# Altium project PRJ_Collar-V1.PrjPcb
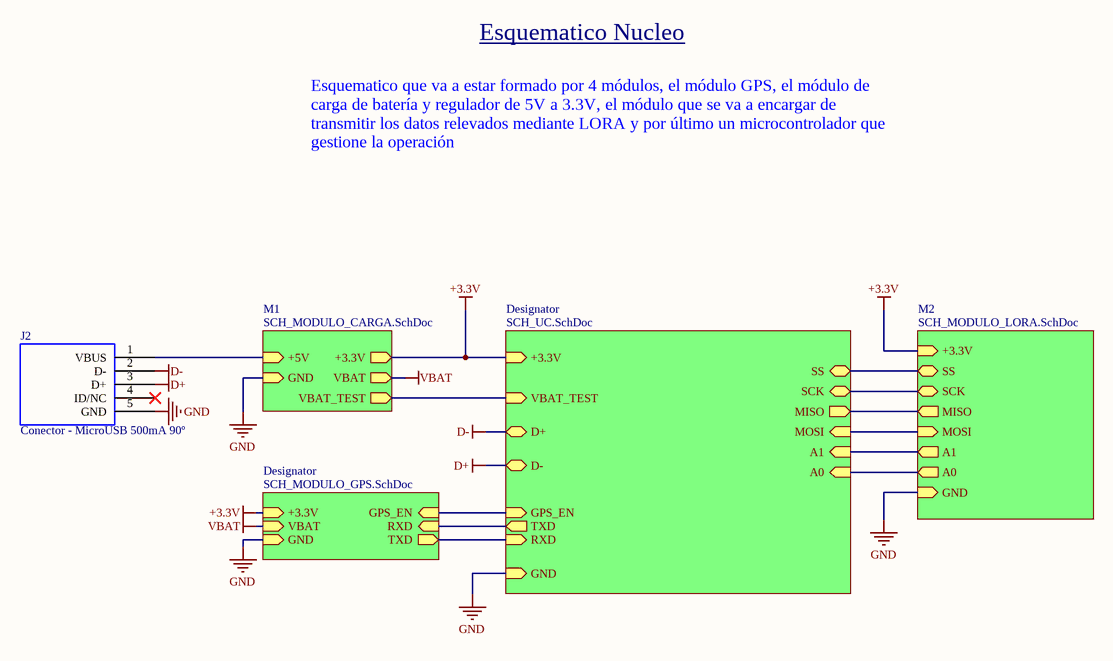
[diagram p0: SCH_NUCLEO.SchDoc]
5 sheets, 52 parts. Net scope: hierarchical (ports join the sheet entries above them; power ports are global).
Sheets:
  SCH_NUCLEO.SchDoc
    M1 = SCH_MODULO_CARGA.SchDoc
    M2 = SCH_MODULO_LORA.SchDoc
    Designator = SCH_MODULO_GPS.SchDoc
    Designator = SCH_UC.SchDoc

## Sheet SCH_NUCLEO.SchDoc
size A4

### Parts
J2  Conector - MicroUSB 500mA 90º

### Sub-sheets
Designator = SCH_MODULO_GPS.SchDoc: +3.3V (in), VBAT (in), GND (in), GPS_EN (in), RXD (in), TXD (out)
Designator = SCH_UC.SchDoc: VBAT_TEST (in), D+ (bidir), MISO (out), A0 (in), GND (in), MOSI (in), +3.3V (in), GPS_EN (in), SCK (bidir), A1 (in), SS (bidir), D- (bidir), TXD (out), RXD (in)
M1 = SCH_MODULO_CARGA.SchDoc: +5V (in), GND (in), +3.3V (out), VBAT (out), VBAT_TEST (out)
M2 = SCH_MODULO_LORA.SchDoc: SCK (bidir), SS (bidir), GND (in), +3.3V (in), MISO (out), MOSI (in), A1 (out), A0 (out)

### Nets
+3.3V: sheet M1/+3.3V, sheet M2/+3.3V, sheet Designator/+3.3V, sheet Designator/+3.3V
+5V: J2.1(VBUS) ; sheet M1/+5V
A0: sheet M2/A0, sheet Designator/A0
A1: sheet M2/A1, sheet Designator/A1
D+: J2.3(D+) ; sheet Designator/D-
D-: J2.2(D-) ; sheet Designator/D+
GND: J2.5(GND) ; sheet M1/GND, sheet M2/GND, sheet Designator/GND, sheet Designator/GND
GPS_EN: sheet Designator/GPS_EN, sheet Designator/GPS_EN
MOSI: sheet M2/MOSI, sheet Designator/MOSI
RXD: sheet Designator/RXD, sheet Designator/TXD
SCK: sheet M2/SCK, sheet Designator/SCK
SPI_MISO: sheet M2/MISO, sheet Designator/MISO
SPI_NSS: sheet M2/SS, sheet Designator/SS
TXD: sheet Designator/TXD, sheet Designator/RXD
VBAT: sheet M1/VBAT, sheet Designator/VBAT
VBAT_TEST: sheet M1/VBAT_TEST, sheet Designator/VBAT_TEST

Not connected (* = marked no-connect by the designer): J2 4(ID/NC)*

### Notes on the sheet
- Esquematico Nucleo
- Esquematico que va a estar formado por 4 módulos, el módulo GPS, el módulo de carga de batería y regulador de 5V a 3.3V, el módulo que se va a encargar de transmitir los datos relevados mediante LORA y por último un microcontrolador que gestione la operación
- 27/06/20
- Fecha
- Cambio Formulario
- Emision Inicial
- Versión
- 00
- Producto
- Código
- Cambio Circuito Eléctrico
- CI N°
- Nivel
- UBM:
- Revisó
- Cód. Formulario
- Realizó
- 1
- PF-ID-014-P
- Aprobó
- Vigencia
- COPIA NO CONTROLADA AL IMPRIMIR
- 15/05/2016
- A4
- Cargo
- 1/1

### Library data of the parts
J2 = Conector - MicroUSB 500mA 90º: Conector Micro USB

## Sheet SCH_MODULO_CARGA.SchDoc
size A4
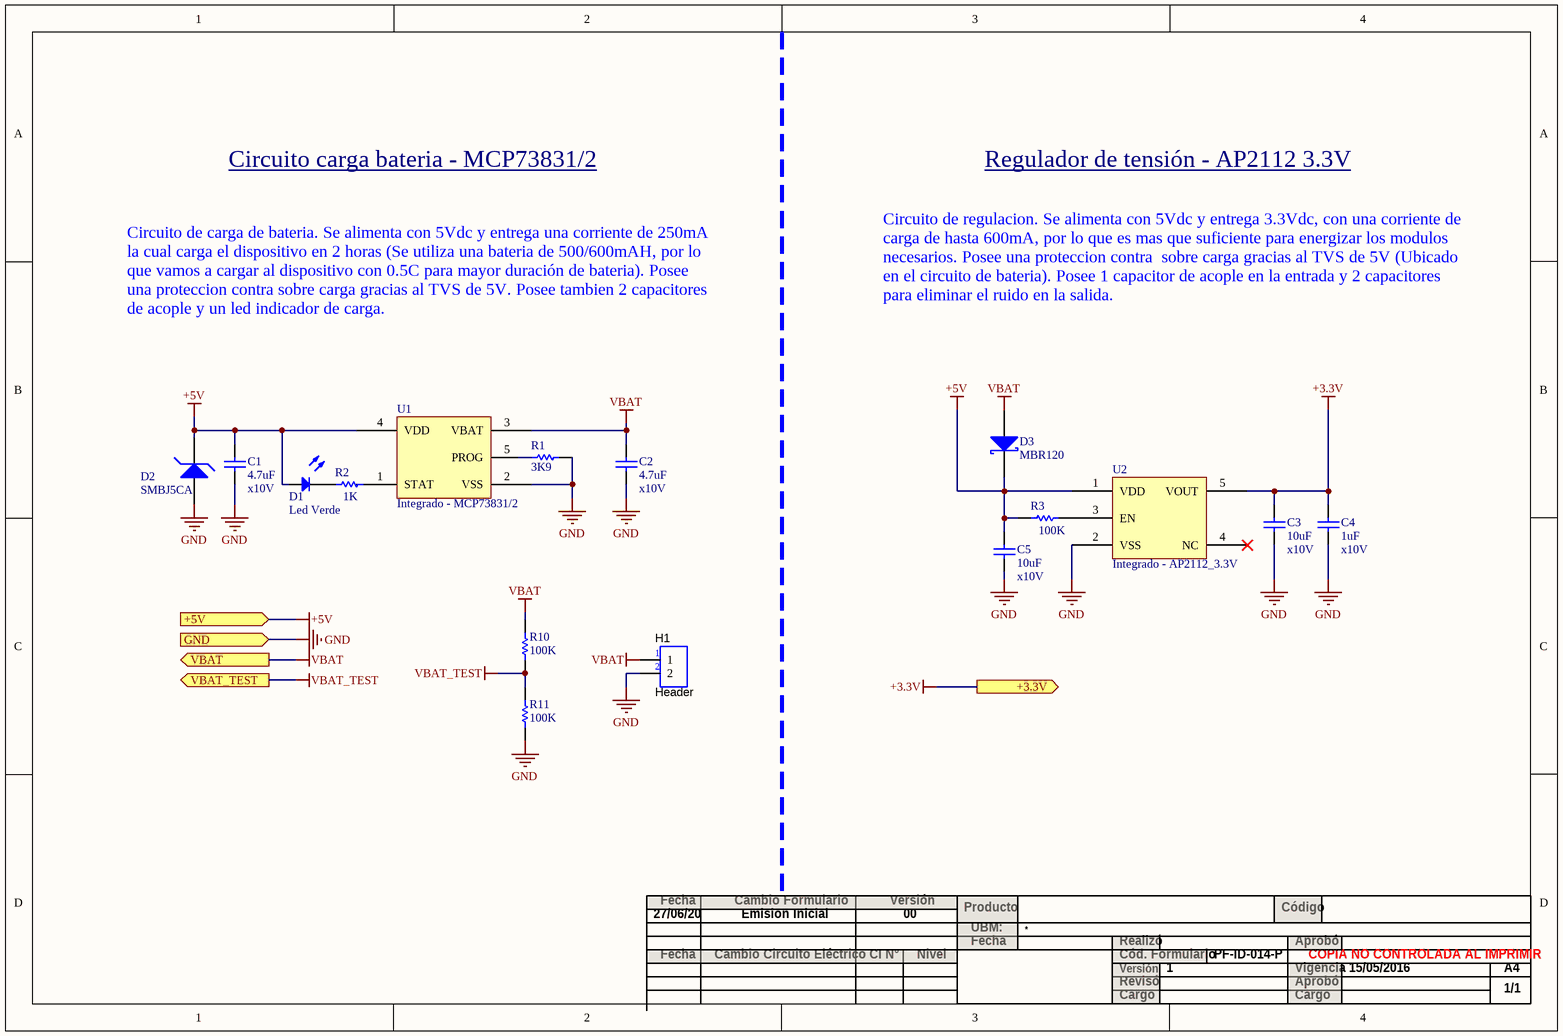
[diagram p1: SCH_MODULO_CARGA.SchDoc]

### Parts
C1  value 4.7uF  Voltage: x10V  [RAD-0.3]  (hidden comment: Capacitor - Común)
C2  value 4.7uF  Voltage: x10V  [RAD-0.3]  (hidden comment: Capacitor - Común)
C3  value 10uF  Voltage: x10V  [RAD-0.3]  (hidden comment: Capacitor - Común)
C4  value 1uF  Voltage: x10V  [RAD-0.3]  (hidden comment: Capacitor - Común)
C5  value 10uF  Voltage: x10V  [RAD-0.3]  (hidden comment: Capacitor - Común)
D1  Led Verde  [LED-0]
D2  SMBJ5CA  [SMC]
D3  MBR120  [SMB]
H1  Header  [HDR_1x2_Offset]  (no BOM)
R1  value 3K9  [Res_0603]  (hidden comment: Resistencia - Común)
R2  value 1K  [Res_0603]  (hidden comment: Resistencia - Común)
R3  value 100K  [Res_0603]  (hidden comment: Resistencia - Común)
R10  value 100K  [AXIAL-0.5]  (hidden comment: Resistencia - Común)
R11  value 100K  [AXIAL-0.5]  (hidden comment: Resistencia - Común)
U1  Integrado - MCP73831/2  [SOT23-5]
U2  Integrado - AP2112_3.3V  [SOT23-5]

### Ports
+3.3V (out), +5V (in), GND (in), VBAT (out), VBAT_TEST (out)

### Nets
+3.3V: C3.2 C4.2 U2.5(VOUT) ; port +3.3V
+5V: C1.1 C5.2 D1.1(A) D2.2(K) D3.2(K) R3.1 U1.4(VDD) U2.1(VDD) ; port +5V
GND: C1.2 C2.1 C3.1 C4.1 C5.1 D2.1(A) H1.2 R1.2 R11.1 U1.2(VSS) U2.2(VSS) ; port GND
VBAT: C2.2 D3.1(A) H1.1 R10.2 U1.3(VBAT) ; port VBAT
VBAT_TEST: R10.1 R11.2 ; port VBAT_TEST
NetD1_2: D1.2(K) R2.1
NetR1_1: R1.1 U1.5(PROG)
NetR3_2: R3.2 U2.3(EN)

Not connected (* = marked no-connect by the designer): R2 2; U1 1(STAT); U2 4(NC)*

### Notes on the sheet
- Circuito carga bateria - MCP73831/2
- Regulador de tensión - AP2112 3.3V
- Circuito de carga de bateria. Se alimenta con 5Vdc y entrega una corriente de 250mA la cual carga el dispositivo en 2 horas (Se utiliza una bateria de 500/600mAH, por lo que vamos a cargar al dispositivo con 0.5C para mayor duración de bateria). Posee una proteccion contra sobre carga gracias al TVS de 5V. Posee tambien 2 capacitores de acople y un led indicador de carga.
- Circuito de regulacion. Se alimenta con 5Vdc y entrega 3.3Vdc, con una corriente de carga de hasta 600mA, por lo que es mas que suficiente para energizar los modulos necesarios. Posee una proteccion contra  sobre carga gracias al TVS de 5V (Ubicado en el circuito de bateria). Posee 1 capacitor de acople en la entrada y 2 capacitores para eliminar el ruido en la salida.
- 27/06/20
- Fecha
- Cambio Formulario
- Emision Inicial
- Versión
- 00
- Producto
- Código
- Cambio Circuito Eléctrico
- CI N°
- Nivel
- UBM:
- Revisó
- Cód. Formulario
- Realizó
- 1
- PF-ID-014-P
- Aprobó
- Vigencia
- COPIA NO CONTROLADA AL IMPRIMIR
- 15/05/2016
- A4
- Cargo
- 1/1

### Library data of the parts
C1-C5 = Capacitor - Común: Capacitor; Published: 8-Jun-2000; LatestRevisionDate: 17-Jul-2002; LatestRevisionNote: Re-released for DXP Platform.; PackageReference: RAD-0.3; Publisher: Altium Limited; PackageDescription: Radial Cap, Thru-Hole; 2 Leads; 0.3 in Pin Spacing
D1 = Diodo - LED: Diodo Led; Published: 8-Jun-2000; LatestRevisionDate: 08-Jul-2005; LatestRevisionNote: Mech Layer 1 removed.; PackageReference: LED-0; Publisher: Altium Limited; PackageDescription: LED; 2 Leads
D2 = Diodo - TVS: Default Diode; Published: 8-Jun-2000; LatestRevisionDate: 17-Jul-2002; LatestRevisionNote: Re-released for DXP Platform.; PackageVersion: Sep-1996; PackageReference: SMC; Publisher: Altium Limited; PackageDescription: DO-214-AB/SMC; 2 C-Bend Leads; Body 7.9 x 5.9 mm, inc. leads (LxW); Code_JEDEC: DO-214-AB
D3 = Diodo - Schottky: Schottky Diode; Published: 8-Jun-2000; LatestRevisionDate: 17-Jul-2002; LatestRevisionNote: Re-released for DXP Platform.; PackageReference: SMB; Publisher: Altium Limited; PackageDescription: DO-214-AA/SMB; 2 C-Bend Leads; Body 5.3 x 3.6 mm, inc. leads (LxW); Code_JEDEC: DO-214-AA
H1 = Conector - 2 Pos: Header, 2-pin
R1-R3 R10 R11 = Resistencia - Común: Semiconductor Resistor; Published: 8-Jun-2000; LatestRevisionDate: 17-Jul-2002; LatestRevisionNote: Re-released for DXP Platform.; PackageReference: AXIAL-0.5; Publisher: Altium Limited; PackageDescription: Axial Device, Thru-Hole; 2 Leads; 0.5 in Pin Spacing
U1 = Integrado - MCP73831/2: Cargador bateria Litio 3,7V
U2 = Integrado - AP2112_3.3V: Regulador 3.3V 600mA

## Sheet SCH_MODULO_LORA.SchDoc
size A4
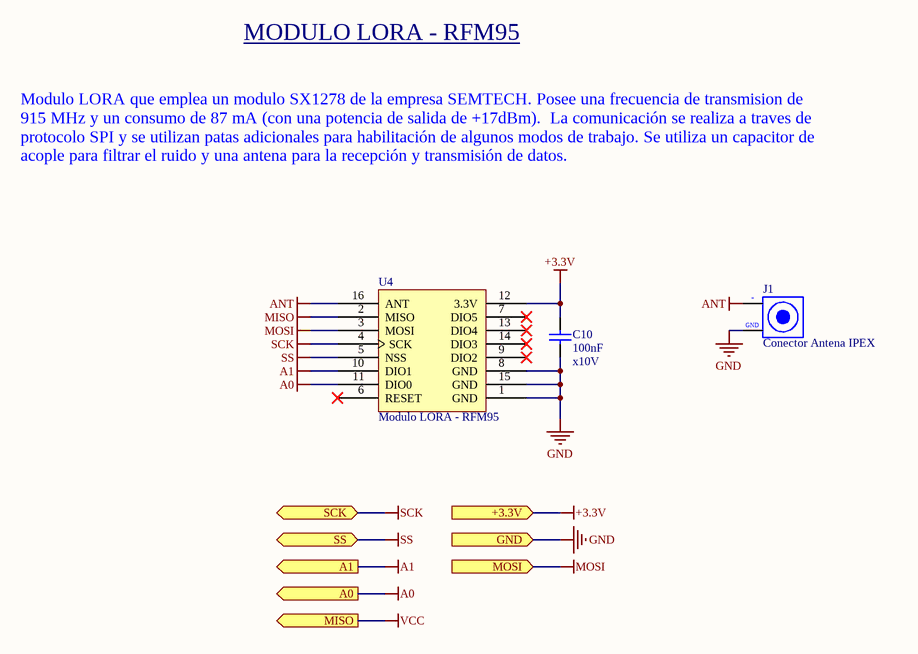
[diagram p2: SCH_MODULO_LORA.SchDoc]

### Parts
C10  value 100nF  Voltage: x10V  [RAD-0.3]  (hidden comment: Capacitor - Común)
J1  Conector Antena IPEX
U4  Modulo LORA - RFM95

### Ports
+3.3V (in), A0 (out), A1 (out), GND (in), MISO (out), MOSI (in), SCK (bidir), SS (bidir)

### Nets
+3.3V: C10.2 U4.12(3.3V) ; port +3.3V
A0: U4.11(DIO0) ; port A0
A1: U4.10(DIO1) ; port A1
ANT: J1.1(ANT) U4.16(ANT)
GND: C10.1 J1.2 U4.1(GND) U4.8(GND) U4.15(GND) ; port GND
MISO: U4.2(MISO)
MOSI: U4.3(MOSI) ; port MOSI
SCK: U4.4(SCK) ; port SCK
SS: U4.5(NSS) ; port SS  [project net SPI_NSS]

Not connected (* = marked no-connect by the designer): U4 6(RESET)* 7(DIO5)* 9(DIO2)* 13(DIO4)* 14(DIO3)*

### Notes on the sheet
- MODULO LORA - RFM95
- Modulo LORA que emplea un modulo SX1278 de la empresa SEMTECH. Posee una frecuencia de transmision de 915 MHz y un consumo de 87 mA (con una potencia de salida de +17dBm).  La comunicación se realiza a traves de protocolo SPI y se utilizan patas adicionales para habilitación de algunos modos de trabajo. Se utiliza un capacitor de acople para filtrar el ruido y una antena para la recepción y transmisión de datos.
- 27/06/20
- Fecha
- Cambio Formulario
- Emision Inicial
- Versión
- 00
- Producto
- Código
- Cambio Circuito Eléctrico
- CI N°
- Nivel
- UBM:
- Revisó
- Cód. Formulario
- Realizó
- 1
- PF-ID-014-P
- Aprobó
- Vigencia
- COPIA NO CONTROLADA AL IMPRIMIR
- 15/05/2016
- A4
- Cargo
- 1/1
- (in symbol Conector Antena IPEX) +; GND

### Library data of the parts
C10 = Capacitor - Común: Capacitor; Published: 8-Jun-2000; LatestRevisionDate: 17-Jul-2002; LatestRevisionNote: Re-released for DXP Platform.; PackageReference: RAD-0.3; Publisher: Altium Limited; PackageDescription: Radial Cap, Thru-Hole; 2 Leads; 0.3 in Pin Spacing
J1 = Conector Antena IPEX: IPEX MHF3
U4 = Modulo LORA - RFM95: RFM95-915-S2

## Sheet SCH_MODULO_GPS.SchDoc
size A4
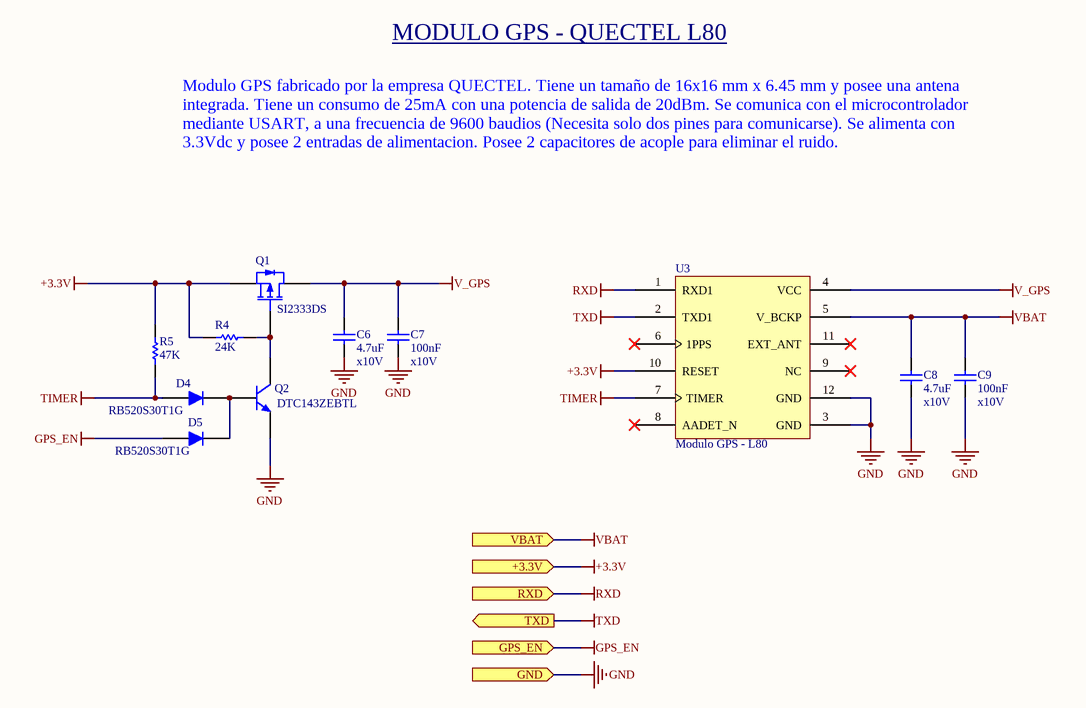
[diagram p3: SCH_MODULO_GPS.SchDoc]

### Parts
C6  value 4.7uF  Voltage: x10V  [RAD-0.3]  (hidden comment: Capacitor - Común)
C7  value 100nF  Voltage: x10V  [RAD-0.3]  (hidden comment: Capacitor - Común)
C8  value 4.7uF  Voltage: x10V  [RAD-0.3]  (hidden comment: Capacitor - Común)
C9  value 100nF  Voltage: x10V  [RAD-0.3]  (hidden comment: Capacitor - Común)
D4  RB520S30T1G  [SMC]
D5  RB520S30T1G  [SMC]
Q1  SI2333DS  [E3]
Q2  DTC143ZEBTL  [TO-92A]
R4  value 24K  [AXIAL-0.5]  (hidden comment: Resistencia - Común)
R5  value 47K  [AXIAL-0.5]  (hidden comment: Resistencia - Común)
U3  Modulo GPS - L80

### Ports
+3.3V (in), GND (in), GPS_EN (in), RXD (in), TXD (out), VBAT (in)

### Nets
+3.3V: Q1.3(S) R4.1 R5.2 U3.10(RESET) ; port +3.3V
GND: C6.1 C7.1 C8.1 C9.1 Q2.1(E) U3.3(GND) U3.12(GND) ; port GND
GPS_EN: D5.1(A) ; port GPS_EN
RXD: U3.1(RXD1) ; port RXD
TIMER: D4.1(A) R5.1 U3.7(TIMER)
TXD: U3.2(TXD1) ; port TXD
V_GPS: C6.2 C7.2 Q1.1(D) U3.4(VCC)
VBAT: C8.2 C9.2 U3.5(V_BCKP) ; port VBAT
NetD4_2: D4.2(K) D5.2(K) Q2.2(B)
NetQ1_2: Q1.2(G) Q2.3(C) R4.2

Not connected (* = marked no-connect by the designer): U3 6(1PPS)* 8(AADET_N)* 9(NC)* 11(EXT_ANT)*

### Notes on the sheet
- MODULO GPS - QUECTEL L80
- Modulo GPS fabricado por la empresa QUECTEL. Tiene un tamaño de 16x16 mm x 6.45 mm y posee una antena integrada. Tiene un consumo de 25mA con una potencia de salida de 20dBm. Se comunica con el microcontrolador mediante USART, a una frecuencia de 9600 baudios (Necesita solo dos pines para comunicarse). Se alimenta con 3.3Vdc y posee 2 entradas de alimentacion. Posee 2 capacitores de acople para eliminar el ruido.
- 27/06/20
- Fecha
- Cambio Formulario
- Emision Inicial
- Versión
- 00
- Producto
- Código
- Cambio Circuito Eléctrico
- CI N°
- Nivel
- UBM:
- Revisó
- Cód. Formulario
- Realizó
- 1
- PF-ID-014-P
- Aprobó
- Vigencia
- COPIA NO CONTROLADA AL IMPRIMIR
- 15/05/2016
- A4
- Cargo
- 1/1

### Library data of the parts
C6-C9 = Capacitor - Común: Capacitor; Published: 8-Jun-2000; LatestRevisionDate: 17-Jul-2002; LatestRevisionNote: Re-released for DXP Platform.; PackageReference: RAD-0.3; Publisher: Altium Limited; PackageDescription: Radial Cap, Thru-Hole; 2 Leads; 0.3 in Pin Spacing
D4 D5 = Diodo - Común: Default Diode; Published: 8-Jun-2000; LatestRevisionDate: 17-Jul-2002; LatestRevisionNote: Re-released for DXP Platform.; PackageVersion: Sep-1996; PackageReference: SMC; Publisher: Altium Limited; PackageDescription: DO-214-AB/SMC; 2 C-Bend Leads; Body 7.9 x 5.9 mm, inc. leads (LxW); Code_JEDEC: DO-214-AB
Q1 = Transistor - MOS/P: P-Channel MOSFET; Published: 8-Jun-2000; LatestRevisionDate: 17-Jul-2002; LatestRevisionNote: Re-released for DXP Platform.; PackageVersion: 1995/1996; PackageReference: E3; Publisher: Altium Limited; PackageDescription: TO, Flat Index; 3 In-Line, Axial Leads; Body Dia. 4.6mm; Lead Dia. 0.5 mm (max)
Q2 = Transistor - NPN: NPN General Purpose Amplifier; Published: 8-Jun-2000; LatestRevisionDate: 15-Jan-2003; LatestRevisionNote: PCB Footprint 'BCY-W3/D4.7' replaced; DatasheetVersion: 1997; PackageVersion: Sep-1998; PackageReference: TO-92A; Publisher: Altium Limited; PackageDescription: TO, Flat Index; 3 In-Line, Axial Leads; Body Dia. 4.5mm; Leads 0.51 x 0.48 mm (max); ComponentLink1Description: Manufacturer Link; ComponentLink1URL: http://www.fairchildsemi.com/; ComponentLink2Description: Datasheet; ComponentLink2URL: http://www.fairchildsemi.com/ds/2N%2F2N3904.pdf
R4 R5 = Resistencia - Común: Semiconductor Resistor; Published: 8-Jun-2000; LatestRevisionDate: 17-Jul-2002; LatestRevisionNote: Re-released for DXP Platform.; PackageReference: AXIAL-0.5; Publisher: Altium Limited; PackageDescription: Axial Device, Thru-Hole; 2 Leads; 0.5 in Pin Spacing
U3 = Modulo GPS - L80: QUECTEL L80

## Sheet SCH_UC.SchDoc
size A4
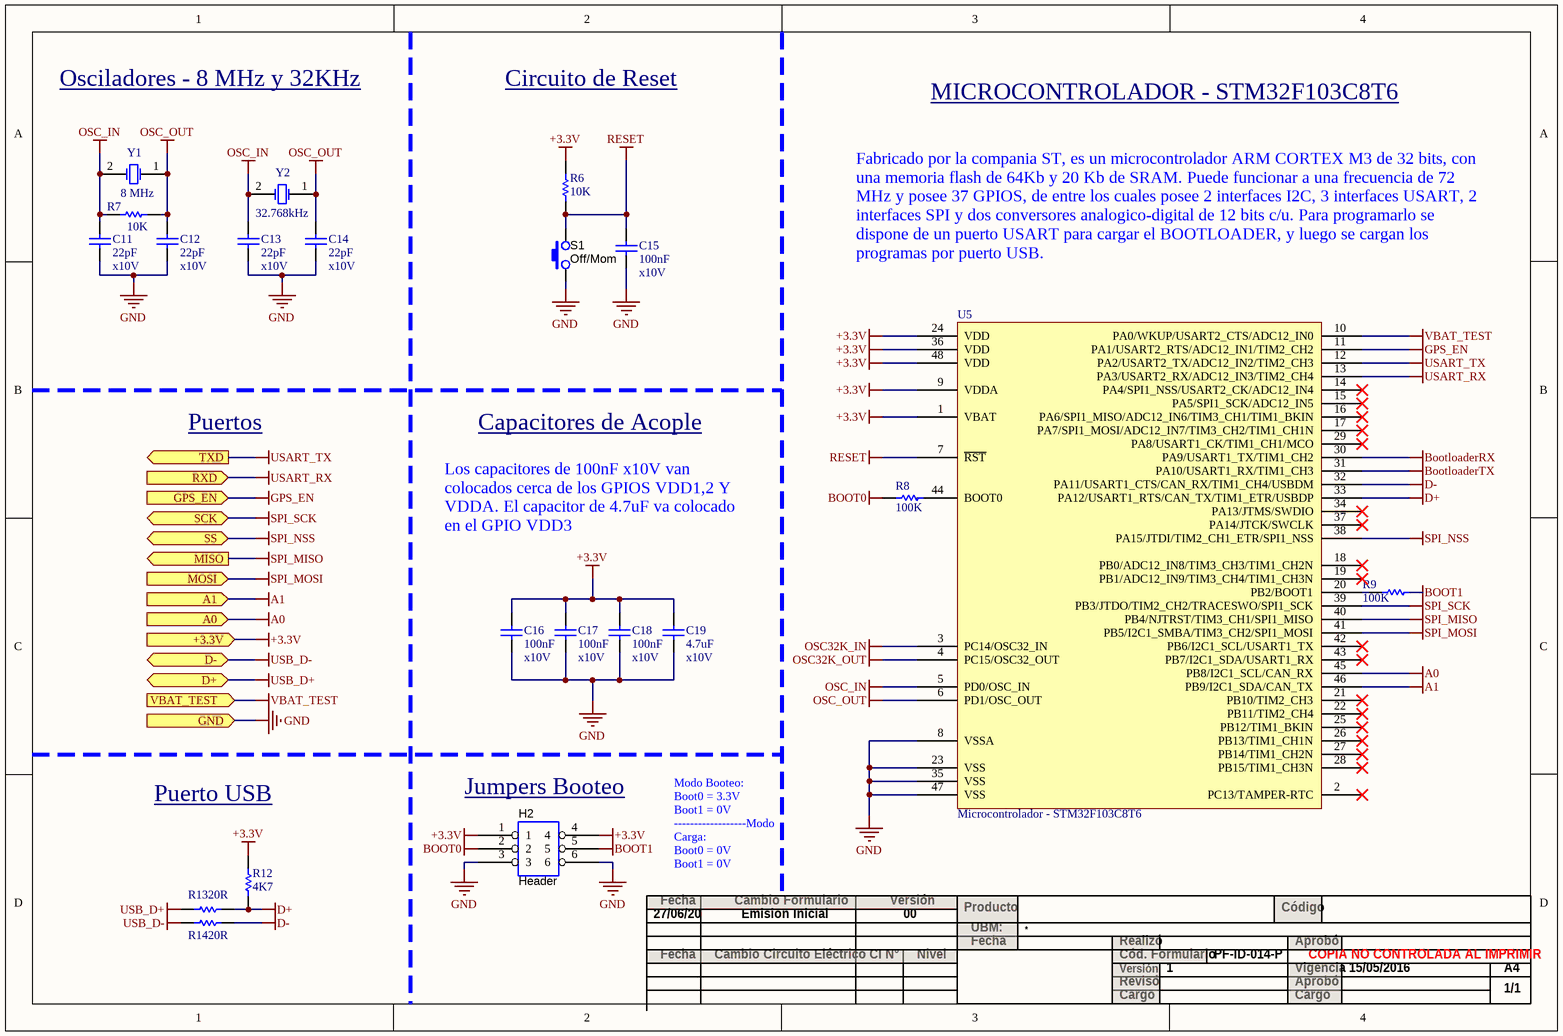
[diagram p4: SCH_UC.SchDoc]

### Parts
C11  value 22pF  Voltage: x10V  [RAD-0.3]  (hidden comment: Capacitor - Común)
C12  value 22pF  Voltage: x10V  [RAD-0.3]  (hidden comment: Capacitor - Común)
C13  value 22pF  Voltage: x10V  [RAD-0.3]  (hidden comment: Capacitor - Común)
C14  value 22pF  Voltage: x10V  [RAD-0.3]  (hidden comment: Capacitor - Común)
C15  value 100nF  Voltage: x10V  [RAD-0.3]  (hidden comment: Capacitor - Común)
C16  value 100nF  Voltage: x10V  [RAD-0.3]  (hidden comment: Capacitor - Común)
C17  value 100nF  Voltage: x10V  [RAD-0.3]  (hidden comment: Capacitor - Común)
C18  value 100nF  Voltage: x10V  [RAD-0.3]  (hidden comment: Capacitor - Común)
C19  value 4.7uF  Voltage: x10V  [RAD-0.3]  (hidden comment: Capacitor - Común)
H2  Header  [HDR_1x2_Offset]  (no BOM)
R6  value 10K  [AXIAL-0.5]  (hidden comment: Resistencia - Común)
R7  value 10K  [AXIAL-0.5]  (hidden comment: Resistencia - Común)
R8  value 100K  [AXIAL-0.5]  (hidden comment: Resistencia - Común)
R9  value 100K  [AXIAL-0.5]  (hidden comment: Resistencia - Común)
R12  value 4K7  [AXIAL-0.5]  (hidden comment: Resistencia - Común)
R13  value 20R  [AXIAL-0.5]  (hidden comment: Resistencia - Común)
R14  value 20R  [AXIAL-0.5]  (hidden comment: Resistencia - Común)
S1  Function: Off/Mom  [SWITCH_DPDT_RA_7201K2A]  (hidden comment: OFF-MOM)
U5  Microcontrolador - STM32F103C8T6
Y1  8 MHz  [R38]
Y2  32.768kHz  [R38]

### Ports
+3.3V (in), A0 (in), A1 (in), D+ (bidir), D- (bidir), GND (in), GPS_EN (in), MISO (out), MOSI (in), RXD (in), SCK (bidir), SS (bidir), TXD (out), VBAT_TEST (in)

### Nets
+3.3V: C16.2 C17.2 C18.2 C19.2 H2.1 H2.4 R6.2 R12.2 U5.1(VBAT) U5.9(VDDA) U5.24(VDD) U5.36(VDD) U5.48(VDD) ; port +3.3V
A0: U5.45(PB8/I2C1_SCL/CAN_RX) ; port A0
A1: U5.46(PB9/I2C1_SDA/CAN_TX) ; port A1
BOOT0: H2.2 R8.2
BOOT1: H2.5 R9.1
BootloaderRX: U5.30(PA9/USART1_TX/TIM1_CH2)
BootloaderTX: U5.31(PA10/USART1_RX/TIM1_CH3)
D+: R12.1 R13.1 R14.2 U5.33(PA12/USART1_RTS/CAN_TX/TIM1_ETR/USBDP) ; port D-  [also labelled USB_D-]
D-: R13.2 R14.1 U5.32(PA11/USART1_CTS/CAN_RX/TIM1_CH4/USBDM) ; port D+  [also labelled USB_D+]
GND: C11.2 C12.2 C13.2 C14.2 C15.1 C16.1 C17.1 C18.1 C19.1 H2.3 H2.6 S1.1 U5.8(VSSA) U5.23(VSS) U5.35(VSS) U5.47(VSS) ; port GND
GPS_EN: U5.11(PA1/USART2_RTS/ADC12_IN1/TIM2_CH2) ; port GPS_EN
OSC32K_IN: U5.3(PC14/OSC32_IN)
OSC32K_OUT: U5.4(PC15/OSC32_OUT)
OSC_IN: C11.1 C13.1 R7.2 U5.5(PD0/OSC_IN) Y1.2(OSC2) Y2.2(OSC2)
OSC_OUT: C12.1 C14.1 R7.1 U5.6(PD1/OSC_OUT) Y1.1(OSC1) Y2.1(OSC1)
RESET: C15.2 R6.1 S1.2 U5.7(~{RST})
SPI_MISO: U5.40(PB4/NJTRST/TIM3_CH1/SPI1_MISO) ; port MISO
SPI_MOSI: U5.41(PB5/I2C1_SMBA/TIM3_CH2/SPI1_MOSI) ; port MOSI  [project net MOSI]
SPI_NSS: U5.38(PA15/JTDI/TIM2_CH1_ETR/SPI1_NSS) ; port SS
SPI_SCK: U5.39(PB3/JTDO/TIM2_CH2/TRACESWO/SPI1_SCK) ; port SCK  [project net SCK]
USART_RX: U5.13(PA3/USART2_RX/ADC12_IN3/TIM2_CH4) ; port RXD  [project net TXD]
USART_TX: U5.12(PA2/USART2_TX/ADC12_IN2/TIM2_CH3) ; port TXD  [project net RXD]
VBAT_TEST: U5.10(PA0/WKUP/USART2_CTS/ADC12_IN0) ; port VBAT_TEST
NetR9_2: R9.2 U5.20(PB2/BOOT1)

Not connected (* = marked no-connect by the designer): R8 1; U5 2(PC13/TAMPER-RTC)* 14(PA4/SPI1_NSS/USART2_CK/ADC12_IN4)* 15(PA5/SPI1_SCK/ADC12_IN5)* 16(PA6/SPI1_MISO/ADC12_IN6/TIM3_CH1/TIM1_BKIN)* 17(PA7/SPI1_MOSI/ADC12_IN7/TIM3_CH2/TIM1_CH1N)* 18(PB0/ADC12_IN8/TIM3_CH3/TIM1_CH2N)* 19(PB1/ADC12_IN9/TIM3_CH4/TIM1_CH3N)* 21(PB10/TIM2_CH3)* 22(PB11/TIM2_CH4)* 25(PB12/TIM1_BKIN)* 26(PB13/TIM1_CH1N)* 27(PB14/TIM1_CH2N)* 28(PB15/TIM1_CH3N)* 29(PA8/USART1_CK/TIM1_CH1/MCO)* 34(PA13/JTMS/SWDIO)* 37(PA14/JTCK/SWCLK)* 42(PB6/I2C1_SCL/USART1_TX)* 43(PB7/I2C1_SDA/USART1_RX)* 44(BOOT0)

### Notes on the sheet
- Osciladores - 8 MHz y 32KHz
- Circuito de Reset
- MICROCONTROLADOR - STM32F103C8T6
- (near U5) Fabricado por la compania ST, es un microcontrolador ARM CORTEX M3 de 32 bits, con una memoria flash de 64Kb y 20 Kb de SRAM. Puede funcionar a una frecuencia de 72 MHz y posee 37 GPIOS, de entre los cuales posee 2 interfaces I2C, 3 interfaces USART, 2 interfaces SPI y dos conversores analogico-digital de 12 bits c/u. Para programarlo se dispone de un puerto USART para cargar el BOOTLOADER, y luego se cargan los programas por puerto USB.
- Puertos
- Capacitores de Acople
- Los capacitores de 100nF x10V van colocados cerca de los GPIOS VDD1,2 Y VDDA. El capacitor de 4.7uF va colocado en el GPIO VDD3
- Puerto USB
- (near H2) Jumpers Booteo
- Modo Booteo:
  Boot0 = 3.3V
  Boot1 = 0V
  ------------------Modo Carga:
  Boot0 = 0V
  Boot1 = 0V
- 27/06/20
- Fecha
- Cambio Formulario
- Emision Inicial
- Versión
- 00
- Producto
- Código
- Cambio Circuito Eléctrico
- CI N°
- Nivel
- UBM:
- Revisó
- Cód. Formulario
- Realizó
- 1
- PF-ID-014-P
- Aprobó
- Vigencia
- COPIA NO CONTROLADA AL IMPRIMIR
- 15/05/2016
- A4
- Cargo
- 1/1

### Library data of the parts
C11-C19 = Capacitor - Común: Capacitor; Published: 8-Jun-2000; LatestRevisionDate: 17-Jul-2002; LatestRevisionNote: Re-released for DXP Platform.; PackageReference: RAD-0.3; Publisher: Altium Limited; PackageDescription: Radial Cap, Thru-Hole; 2 Leads; 0.3 in Pin Spacing
H2 = Conector - 6 Pos: Header, 6-pin
R6-R9 R12-R14 = Resistencia - Común: Semiconductor Resistor; Published: 8-Jun-2000; LatestRevisionDate: 17-Jul-2002; LatestRevisionNote: Re-released for DXP Platform.; PackageReference: AXIAL-0.5; Publisher: Altium Limited; PackageDescription: Axial Device, Thru-Hole; 2 Leads; 0.5 in Pin Spacing
S1 = Conector - Switch: Switch wire leads momentary SPST; Manufacturer 1: Judco Manufacturing Inc; Manufacturer Part Number 1: 40-2390-00; SCDType: spec; Package / Case: Panel-mount with wire leads; Supplier 1: Digi-Key; Supplier Part Number 1: 506PB-ND
U5 = Microcontrolador - STM32F103C8T6: ARM Cortex-M3 MCU with 64 Kbytes Flash, 72 MHz CPU
Y1 Y2 = Cristal Oscilador: Crystal Oscillator; Published: 8-Jun-2000; LatestRevisionDate: 17-Jul-2002; LatestRevisionNote: Re-released for DXP Platform.; PackageReference: R38; Publisher: Altium Limited; PackageDescription: Crystal, Thru-Hole; 2 Leads; Body 3.1 x 8.2 mm (Dia.xH)

## Nets that join several sheets
+3.3V: SCH_MODULO_CARGA (C3.2 C4.2 U2.5), SCH_MODULO_LORA (C10.2 U4.12), SCH_MODULO_GPS (Q1.3 R4.1 R5.2 U3.10), SCH_UC (13 pins)
+5V: SCH_NUCLEO (J2.1), SCH_MODULO_CARGA (8 pins)
A0: SCH_MODULO_LORA (U4.11), SCH_UC (U5.45)
A1: SCH_MODULO_LORA (U4.10), SCH_UC (U5.46)
D+: SCH_NUCLEO (J2.3), SCH_UC (R12.1 R13.1 R14.2 U5.33)
D-: SCH_NUCLEO (J2.2), SCH_UC (R13.2 R14.1 U5.32)
GND: SCH_NUCLEO (J2.5), SCH_MODULO_CARGA (11 pins), SCH_MODULO_LORA (5 pins), SCH_MODULO_GPS (7 pins), SCH_UC (16 pins)
GPS_EN: SCH_MODULO_GPS (D5.1), SCH_UC (U5.11)
MOSI: SCH_MODULO_LORA (U4.3), SCH_UC (U5.41)
RXD: SCH_MODULO_GPS (U3.1), SCH_UC (U5.12)
SCK: SCH_MODULO_LORA (U4.4), SCH_UC (U5.39)
SPI_NSS: SCH_MODULO_LORA (U4.5), SCH_UC (U5.38)
TXD: SCH_MODULO_GPS (U3.2), SCH_UC (U5.13)
VBAT: SCH_MODULO_CARGA (5 pins), SCH_MODULO_GPS (C8.2 C9.2 U3.5)
VBAT_TEST: SCH_MODULO_CARGA (R10.1 R11.2), SCH_UC (U5.10)